# Altium schematic sheet Base_Module.SchDoc
size B; SheetNumber: 2; SheetTotal: 4
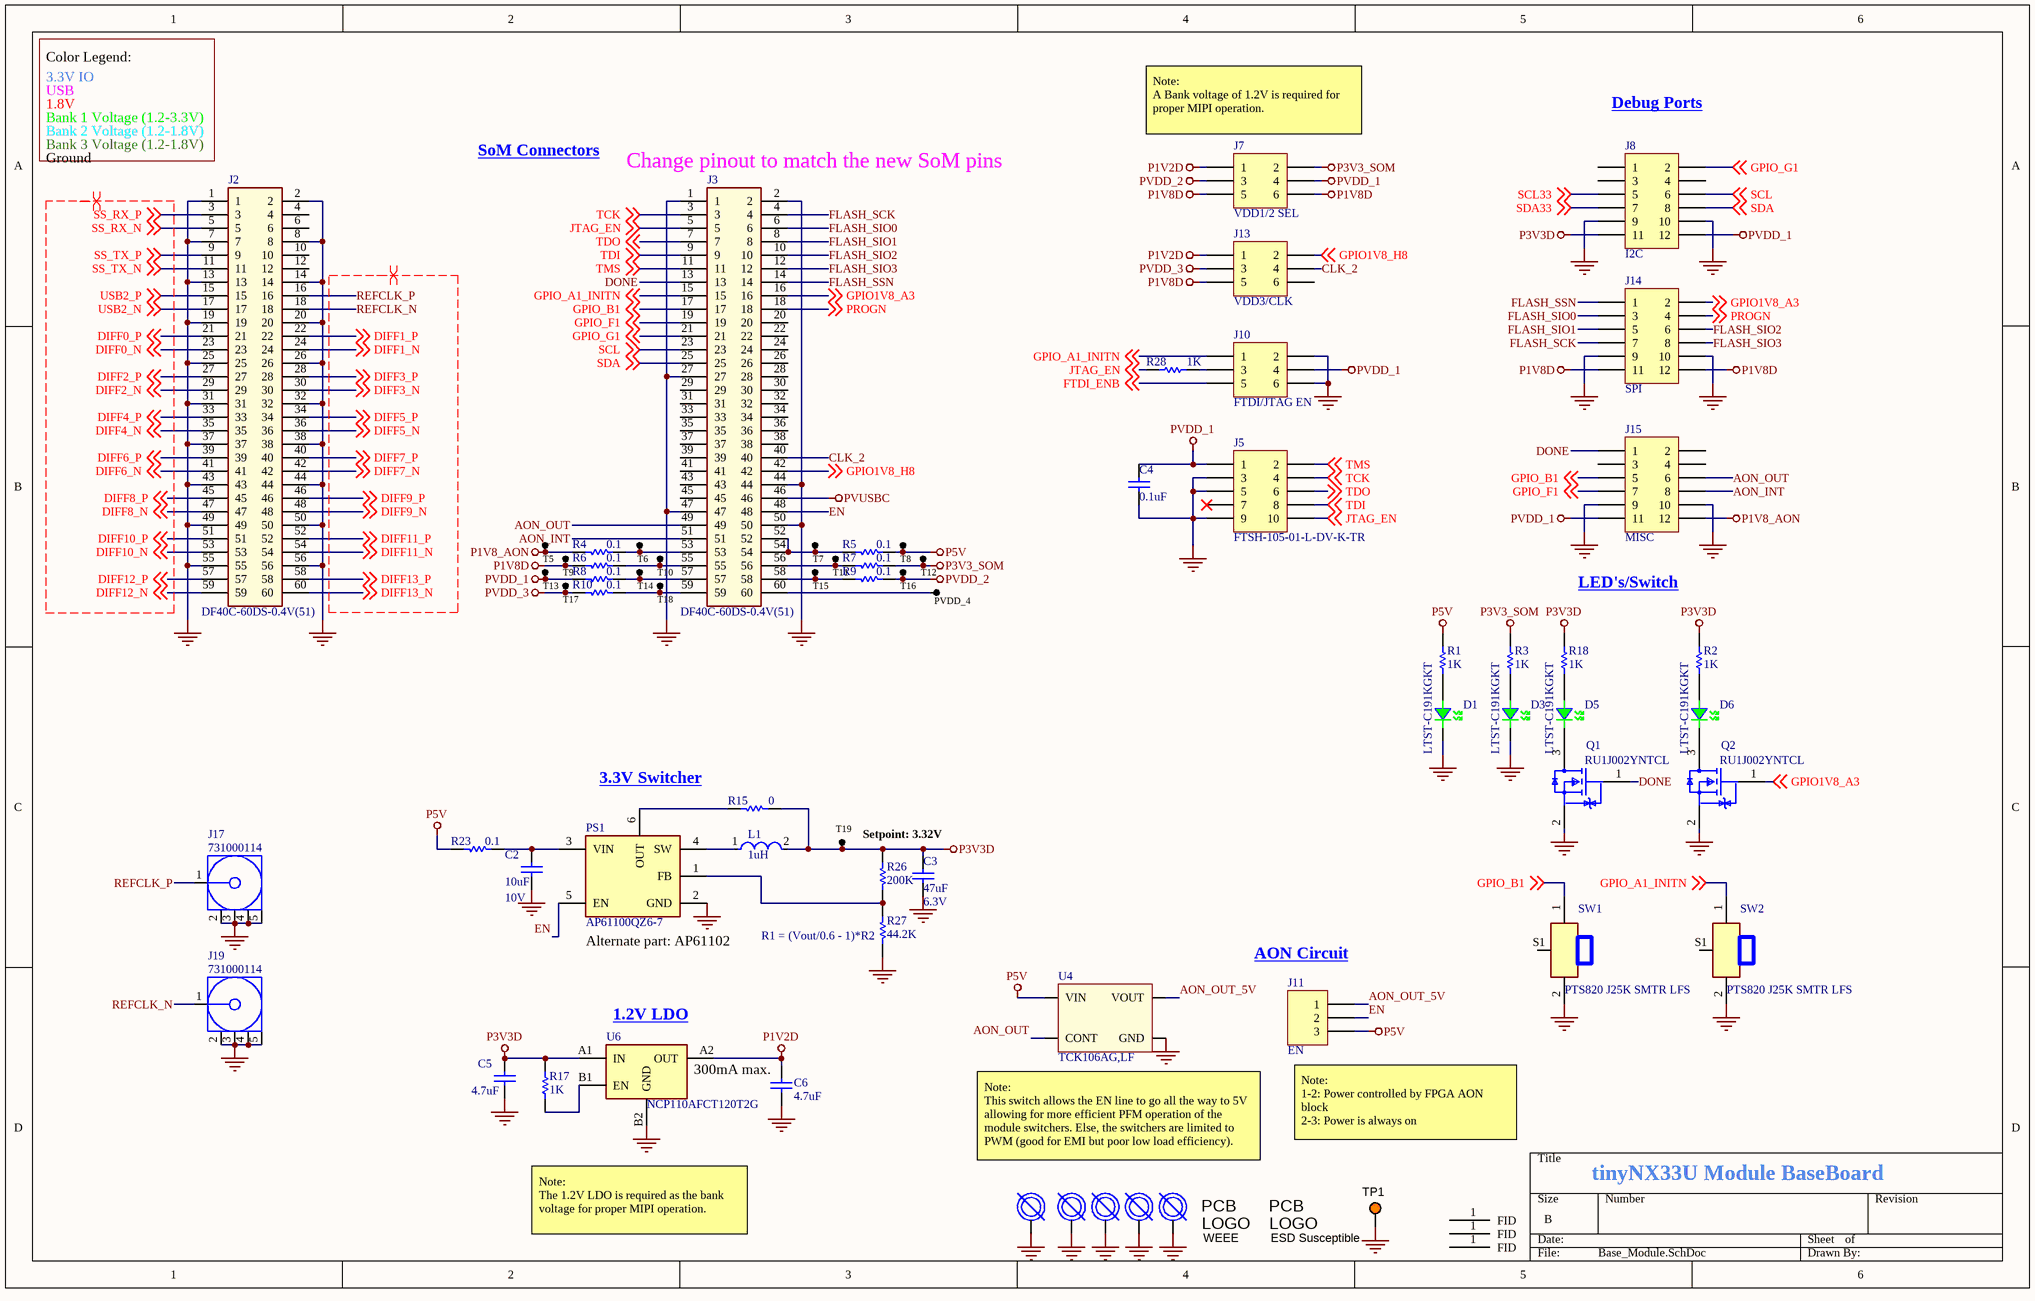
[diagram p0: Base_Module.SchDoc]

## Parts
BH1  STANDOFF M2.5  [MH_3MM]  (value not drawn)  (no BOM)
BH2  STANDOFF M2.5  [MH_3MM]  (value not drawn)  (no BOM)
BH3  STANDOFF M2.5  [MH_3MM]  (value not drawn)  (no BOM)
BH4  STANDOFF M2.5  [MH_3MM]  (value not drawn)  (no BOM)
BH5  STANDOFF M2.5  [MH_3MM]  (value not drawn)  (no BOM)
C2  10uF  Voltage: 10V  [CAP_0603]
C3  47uF  Voltage: 6.3V  [CAP_0603]
C4  0.1uF  [CAPC1005X55USR]
C5  4.7uF  [CAPC1005X55USR]
C6  4.7uF  [CAPC1005X55USR]
D1  LTST-C191KGKT  [LED_0603]
D3  LTST-C191KGKT  [LED_0603]
D5  LTST-C191KGKT  [LED_0603]
D6  LTST-C191KGKT  [LED_0603]
FID1  (no value)  [FID_040]  (no BOM)
FID2  (no value)  [FID_040]  (no BOM)
FID3  (no value)  [FID_040]  (no BOM)
J2  DF40C-60DS-0.4V(51)  [DF40C60DS04V51]
J3  DF40C-60DS-0.4V(51)  [DF40C60DS04V51]
J5  FTSH-105-01-L-DV-K-TR  [FTSH-105-01-XXX-DV-K]
J7  Content: VDD1/2 SEL  [HDR3X2_MALE_2.54MM_SAMTEC-A-TSM-103]  (hidden comment: Header 3X2_SMD)
J8  Content: I2C  [HDR6X2_MALE_2.54MM_SAMTEC-A-TSM-106]  (hidden comment: Header 6X2_SMD)
J10  Content: FTDI/JTAG EN  [HDR3X2_MALE_2.54MM_SAMTEC-A-TSM-103]  (hidden comment: Header 3X2_SMD)
J11  Content: EN  [HDR3X1_MALE_2.54MM]  (hidden comment: Header 3X1_2.54MM)
J13  Content: VDD3/CLK  [HDR3X2_MALE_2.54MM_SAMTEC-A-TSM-103]  (hidden comment: Header 3X2_SMD)
J14  Content: SPI  [HDR6X2_MALE_2.54MM_SAMTEC-A-TSM-106]  (hidden comment: Header 6X2_SMD)
J15  Content: MISC  [HDR6X2_MALE_2.54MM_SAMTEC-A-TSM-106]  (hidden comment: Header 6X2_SMD)
J17  731000114  [0731000114]
J19  731000114  [0731000114]
L1  1uH  [INDC2016X100N]
Logo1  WEEE  [WEEE_Minimum]  (no BOM)
Logo2  ESD Susceptible  [ESD_Overlay_Medium]  (no BOM)
PS1  AP61100QZ6-7  [SOTFL50P160X60-6N]
PVDD_4  TP_S  [TP_TH]  (value not drawn)  (no BOM)
Q1  RU1J002YNTCL  [SOT-323FL]
Q2  RU1J002YNTCL  [SOT-323FL]
R1  1K  [RESC1005X40USR]
R2  1K  [RESC1005X40USR]
R3  1K  [RESC1005X40USR]
R4  0.1  [RESC1005X40USR]
R5  0.1  [RESC1005X40USR]
R6  0.1  [RESC1005X40USR]
R7  0.1  [RESC1005X40USR]
R8  0.1  [RESC1005X40USR]
R9  0.1  [RESC1005X40USR]
R10  0.1  [RESC1005X40USR]
R15  0  [RESC1005X40USR]
R17  1K  [RESC1005X40USR]
R18  1K  [RESC1005X40USR]
R23  0.1  [RESC1005X40USR]
R26  200K  [RESC1005X40USR]
R27  44.2K  [RESC1005X40USR]
R28  1K  [RESC1005X40USR]
SW1  PTS820 J25K SMTR LFS  [PTS820J25MSMTRLFS]
SW2  PTS820 J25K SMTR LFS  [PTS820J25MSMTRLFS]
T5  TP_S  [TP_TH]  (value not drawn)  (no BOM)
T6  TP_S  [TP_TH]  (value not drawn)  (no BOM)
T7  TP_S  [TP_TH]  (value not drawn)  (no BOM)
T8  TP_S  [TP_TH]  (value not drawn)  (no BOM)
T9  TP_S  [TP_TH]  (value not drawn)  (no BOM)
T10  TP_S  [TP_TH]  (value not drawn)  (no BOM)
T11  TP_S  [TP_TH]  (value not drawn)  (no BOM)
T12  TP_S  [TP_TH]  (value not drawn)  (no BOM)
T13  TP_S  [TP_TH]  (value not drawn)  (no BOM)
T14  TP_S  [TP_TH]  (value not drawn)  (no BOM)
T15  TP_S  [TP_TH]  (value not drawn)  (no BOM)
T16  TP_S  [TP_TH]  (value not drawn)  (no BOM)
T17  TP_S  [TP_TH]  (value not drawn)  (no BOM)
T18  TP_S  [TP_TH]  (value not drawn)  (no BOM)
T19  3V3  [TP 1mm]  (value not drawn)  (no BOM)
TP1  5019  [TP380X203]  (value not drawn)
U4  TCK106AG,LF  [WCSP4D]
U6  NCP110AFCT120T2G  [WLCSP4_P6XP6_ONS]

## Nets
GND: BH1.1 BH2.1 BH3.1 BH4.1 BH5.1 C2.1 C3.1 C4.1 C5.1 C6.1 D1.2(K) D3.2(K) J2.1 J2.2 J2.7 J2.8 J2.13 J2.14 J2.19 J2.20 J2.25 J2.26 J2.31 J2.32 J2.37 J2.38 J2.43 J2.44 J2.49 J2.50 J2.55 J2.56 J3.1 J3.2 J3.27 J3.44 J3.47 J3.50 J5.3 J5.5 J5.9 J8.9 J8.10 J10.2 J10.6 J14.9 J14.10 J15.9 J15.10 J17.2 J17.3 J17.4 J17.5 J19.2 J19.3 J19.4 J19.5 PS1.2(GND) Q1.2(S) Q2.2(S) R27.1 SW1.2 SW2.2 TP1.1 U4.B1(GND) U6.B2(GND)
P1V2D: C6.2 J7.1 J13.1 U6.A2(OUT)
P1V8_AON: J15.12 R4.2 T5.1
P1V8D: J7.5 J7.6 J13.5 J14.11 J14.12 R6.2 T9.1
P3V3_SOM: J7.2 R3.1 R7.1 T12.1
P3V3D: C3.2 C5.2 J8.11 L1.2 R2.1 R15.1 R17.1 R18.1 R26.2 T19.1 U6.A1(IN)
P5V: J11.3 R1.1 R5.1 R23.2 T8.1 U4.A2(VIN)
PVDD_1: C4.2 J5.1 J7.4 J8.12 J10.4 J15.11 R8.2 T13.1
PVDD_2: J7.3 R9.1 T16.1
PVDD_3: J13.3 R10.2 T17.1
PVUSBC: J3.46
AON_INT: J3.51 J15.8
AON_OUT: J3.49 J15.6 U4.B2(CONT)
AON_OUT_5V: J11.1 U4.A1(VOUT)
CLK_2: J3.40 J13.4
DIFF0_N: J2.23 ; off-sheet DIFF0_N
DIFF0_P: J2.21 ; off-sheet DIFF0_P
DIFF1_N: J2.24 ; off-sheet DIFF1_N
DIFF1_P: J2.22 ; off-sheet DIFF1_P
DIFF2_N: J2.29 ; off-sheet DIFF2_N
DIFF2_P: J2.27 ; off-sheet DIFF2_P
DIFF3_N: J2.30 ; off-sheet DIFF3_N
DIFF3_P: J2.28 ; off-sheet DIFF3_P
DIFF4_N: J2.35 ; off-sheet DIFF4_N
DIFF4_P: J2.33 ; off-sheet DIFF4_P
DIFF5_N: J2.36 ; off-sheet DIFF5_N
DIFF5_P: J2.34 ; off-sheet DIFF5_P
DIFF6_N: J2.41 ; off-sheet DIFF6_N
DIFF6_P: J2.39 ; off-sheet DIFF6_P
DIFF7_N: J2.42 ; off-sheet DIFF7_N
DIFF7_P: J2.40 ; off-sheet DIFF7_P
DIFF8_N: J2.47 ; off-sheet DIFF8_N
DIFF8_P: J2.45 ; off-sheet DIFF8_P
DIFF9_N: J2.48 ; off-sheet DIFF9_N
DIFF9_P: J2.46 ; off-sheet DIFF9_P
DIFF10_N: J2.53 ; off-sheet DIFF10_N
DIFF10_P: J2.51 ; off-sheet DIFF10_P
DIFF11_N: J2.54 ; off-sheet DIFF11_N
DIFF11_P: J2.52 ; off-sheet DIFF11_P
DIFF12_N: J2.59 ; off-sheet DIFF12_N
DIFF12_P: J2.57 ; off-sheet DIFF12_P
DIFF13_N: J2.60 ; off-sheet DIFF13_N
DIFF13_P: J2.58 ; off-sheet DIFF13_P
DONE: J3.13 J15.1 Q1.1(G)
EN: J3.48 J11.2 PS1.5(EN)
FLASH_SCK: J3.4 J14.7
FLASH_SIO0: J3.6 J14.3
FLASH_SIO1: J3.8 J14.5
FLASH_SIO2: J3.10 J14.6
FLASH_SIO3: J3.12 J14.8
FLASH_SSN: J3.14 J14.1
FTDI_ENB: J10.5 ; off-sheet FTDI_ENB
GPIO1V8_A3: J3.16 J14.2 Q2.1(G) ; off-sheet GPIO1V8_A3
GPIO1V8_H8: J3.42 J13.2 ; off-sheet GPIO1V8_H8
GPIO_A1_INITN: J3.15 J10.1 SW2.1 ; off-sheet GPIO_A1_INITN
GPIO_B1: J3.17 J15.5 SW1.1 ; off-sheet GPIO_B1
GPIO_F1: J3.19 J15.7 ; off-sheet GPIO_F1
GPIO_G1: J3.21 J8.2 ; off-sheet GPIO_G1
JTAG_EN: J3.5 J5.10 R28.1 ; off-sheet JTAG_EN
PROGN: J3.18 J14.4 ; off-sheet PROGN
REFCLK_N: J2.18 J19.1
REFCLK_P: J2.16 J17.1
SCL: J3.23 J8.6 ; off-sheet SCL
SCL33: J8.5 ; off-sheet SCL33
SDA: J3.25 J8.8 ; off-sheet SDA
SDA33: J8.7 ; off-sheet SDA33
SS_RX_N: J2.5 ; off-sheet SS_RX_N
SS_RX_P: J2.3 ; off-sheet SS_RX_P
SS_TX_N: J2.11 ; off-sheet SS_TX_N
SS_TX_P: J2.9 ; off-sheet SS_TX_P
TCK: J3.3 J5.4 ; off-sheet TCK
TDI: J3.9 J5.8 ; off-sheet TDI
TDO: J3.7 J5.6 ; off-sheet TDO
TMS: J3.11 J5.2 ; off-sheet TMS
USB2_N: J2.17 ; off-sheet USB2_N
USB2_P: J2.15 ; off-sheet USB2_P
NetC2_2: C2.2 PS1.3(VIN) R23.1
NetD1_1: D1.1(A) R1.2
NetD3_1: D3.1(A) R3.2
NetD5_1: D5.1(A) R18.2
NetD5_2: D5.2(K) Q1.3(D)
NetD6_1: D6.1(A) R2.2
NetD6_2: D6.2(K) Q2.3(D)
NetJ3_52: J3.52 J3.54 R5.2 T7.1
NetJ3_53: J3.53 R4.1 T6.1
NetJ3_55: J3.55 R6.1 T10.1
NetJ3_56: J3.56 R7.2 T11.1
NetJ3_57: J3.57 R8.1 T14.1
NetJ3_58: J3.58 R9.2 T15.1
NetJ3_59: J3.59 R10.1 T18.1
NetJ3_60: J3.60 PVDD_4.1
NetJ10_3: J10.3 R28.2
NetL1_1: L1.1 PS1.4(SW)
NetPS1_1: PS1.1(FB) R26.1 R27.2
NetPS1_6: PS1.6(OUT) R15.2
NetR17_2: R17.2 U6.B1(EN)

Not connected (* = marked no-connect by the designer): FID1 1(FID); FID2 1(FID); FID3 1(FID); J2 4 6 10 12; J3 20 22 24 26 28 29 30 31 32 33 34 35 36 37 38 39 41 43 45; J5 7*; J8 1 3 4; J13 6; J15 2 3 4; SW1 S1(GND); SW2 S1(GND)

## Layout directives
differential pair: DIFF0_N, DIFF0_P, DIFF1_N, DIFF1_P, DIFF2_N, DIFF2_P, DIFF3_N, DIFF3_P, DIFF4_N, DIFF4_P, DIFF5_N, DIFF5_P, DIFF6_N, DIFF6_P, DIFF7_N, DIFF7_P, DIFF8_N, DIFF8_P, DIFF9_N, DIFF9_P, DIFF10_N, DIFF10_P, DIFF11_N, DIFF11_P, DIFF12_N, DIFF12_P, DIFF13_N, DIFF13_P, REFCLK_N, REFCLK_P, SS_RX_N, SS_RX_P, SS_TX_N, SS_TX_P, USB2_N, USB2_P

## Notes on the sheet
- 3.3V IO
- USB
- Color Legend:
- 1.8V
- Bank 2 Voltage (1.2-1.8V)
- Bank 1 Voltage (1.2-3.3V)
- Ground
- (near J2) Bank 3 Voltage (1.2-1.8V)
- SoM Connectors
- (near J7) Note:
  A Bank voltage of 1.2V is required for proper MIPI operation.
- Debug Ports
- (near J3) Change pinout to match the new SoM pins
- LED's/Switch
- 3.3V Switcher
- Setpoint: 3.32V
- (near PS1) Alternate part: AP61102
- (near R27) R1 = (Vout/0.6 - 1)*R2
- (near J11) AON Circuit
- (near U6) 1.2V LDO
- (near U6) 300mA max.
- Note:
  This switch allows the EN line to go all the way to 5V allowing for more efficient PFM operation of the module switchers. Else, the switchers are limited to PWM (good for EMI but poor low load efficiency).
- (near J11) Note:
  1-2: Power controlled by FPGA AON block
  2-3: Power is always on
- tinyNX33U Module BaseBoard
- Note:
  The 1.2V LDO is required as the bank voltage for proper MIPI operation.
- (in symbol Logo ESD) PCB; LOGO
- (in symbol Logo WEEE) PCB; LOGO

## Library data of the parts
BH1-BH5 = MOUNT_HOLE: ROUND STANDOFF M2X0.4 STEEL 1MM
C2 = Cap_1uF_X5R_10%_6V3_0402: CAP CER 10uF 10V X5R 0603; Manufacturer Part Number: GRM188R61A106ME69D; Manufacturer: Murata Electronics; Supplier Part Number 1: 490-10475-1-ND; Package: 0603; value: 10uF; Supplier 1: Digi-Key; Height: 0.95mm; ComponentLink1Description: New link; ComponentLink1URL: *
C3 = Cap_1uF_X5R_10%_6V3_0402: CAP CER 47UF 6.3V X5R 0603; Manufacturer Part Number: GRM188R60J476ME15D; Manufacturer: Murata Electronics; Supplier Part Number 1: 490-13247-1-ND; Package: 0603; value: 47uF; Supplier 1: Digi-Key; Height: 1.0mm; ComponentLink1Description: New link; ComponentLink1URL: *
C4 = CAP CER 0.1UF 16V X7R 0402: Manufacturer Part Number: CGA2B1X7R1C104K050BC; Manufacturer: TDK Corporation; Supplier Part Number 1: 445-5613-2-ND; Package: 0402; Height: 0.55mm; Supplier 1: Digi-Key; value: 0.1uF
C5 C6 = CAP CER 4.7UF 10V X5R 0402: Manufacturer Part Number: C1005X5R1A475M050BC; Manufacturer: TDK Corporation; Supplier Part Number 1: 445-8023-1-ND; Package: 0402; value: 4.7uF; Supplier 1: Digi-Key; Height: 0.55mm; ComponentLink1Description: New link; ComponentLink1URL: *
D1 D3 D5 D6 = 0603LED_GRN: LED GREEN CLEAR CHIP 0603 SMD; Manufacturer: Lite-On Inc.; Manufacturer Part Number: LTST-C191GKT; Unit Cost, Qty 1: $0.68; Unit Cost, Qty 500: $0.293; Supplier Part Number 1: 160-1443-1-ND; Value: LTST-C191KGKT; Supplier 1: Digi-Key
FID1-FID3 = FID: Notes: DNP
J2 J3 = DF40C-60DS-0.4V(51): CONN RCPT 60POS SMD GOLD; Manufacturer: Hirose; Connector Type: Receptacle; Number of Positions: 60; Current Rating: 300mA; Voltage Rating: 30V; Pitch: 0.4mm; Mated Stacking Heights: 1.5mm; Manufacturer Part Number: DF40C-60DS-0.4V(51); RoHS: Yes; Category: Headers and Wire Housings; Stock: 11621; Pricing: 1=1.29000, 10=1.08900, 25=1.04440, 50=1.02220, 100=0.97770, 250=0.88880, 500=0.79992, 1000=0.71104, 2500=0.64438 (USD); Mounting Technology: Surface Mount; Contact Plating: Gold; Contact Material: Bronze; Housing Material: Polymer; Package Quantity: 5000; Number of Rows: 2; Packaging: Tape and Reel; Series: DF40; Termination: SMD/SMT; Number of Contacts: 60; Gender: Receptacle; RoHS Compliant: Yes; Lead Free: Lead Free; Reach SVHC Compliant: No; ComponentLink1URL: https://datasheet.ciiva.com/46408/1824826-46408909.pdf?src-supplier=Element14; ComponentLink1Description: https://datasheet.ciiva.com/46408/1824826-46408909.pdf?src-supplier=Element14; Supplier 1: Digi-Key; Supplier Part Number 1: 26-DF40C-60DS-0.4V(51)CT-ND
J5 = HDR2X5_1.27mm: CONN HEADER SMD 10POS 1.27MM; Manufacturer: Samtec Inc.; Max Current Rating: 1.75A; Number of Contacts: 10; Gender: Male; Connector Type: Male Pin; Row Spacing: 0.05inch; Supplier 1: Digi-Key; Supplier Part Number 1: SAM13165CT-ND; Manufacturer Part Number: FTSH-105-01-L-DV-K-TR; RoHS: Yes; Category: Headers and Wire Housings; Stock 1: 18878; Pricing 1: 1=4.28000, 10=3.88500, 100=3.42300 (USD); Mount: Surface Mount; Contact Plating: Gold; Contact Material: Bronze; Housing Color: Black; Housing Material: Polymer; Color: Black; Min Operating Temperature: -55°C; Max Operating Temperature: 125°C; Number of Rows: 2; Packaging: Tape and Reel; Termination: Solder; Orientation: Straight; Package Quantity: 550; Number of Positions: 10; Current Rating: 1.75A; Series: FTSH; Contact Type: Male Pin; Length: 6.35mm; Pitch: 1.27mm; Depth: 3.43mm; Contact Mating Length: 0.12inch; Radiation Hardening: No; Lead Free: Lead Free; RoHS Compliant: Yes; REACH SVHC: No SVHC; ComponentLink1URL: https://datasheet.ciiva.com/10245/ftsh-mt-10245289.pdf?src-supplier=Avnet; ComponentLink1Description: https://datasheet.ciiva.com/10245/ftsh-mt-10245289.pdf?src-supplier=Avnet; ComponentLink2URL: https://datasheet.ciiva.com/739/ftsh-1xx-xx-xxx-dv-xxx-mkt-739005.pdf?src-supplier=Digi-Key; ComponentLink2Description: https://datasheet.ciiva.com/739/ftsh-1xx-xx-xxx-dv-xxx-mkt-739005.pdf?src-supplier=Digi-Key; ComponentLink3URL: https://datasheet.ciiva.com/23735/81359-23735917.pdf?src-supplier=Newark; ComponentLink3Description: https://datasheet.ciiva.com/23735/81359-23735917.pdf?src-supplier=Newark
J7 J10 J13 = Header 3X2_SMD: Conn Unshrouded Header HDR 6 POS 2.54mm Solder ST Top Entry SMD Tube; Manufacturer: Samtec; Manufacturer Part Number: TSM-103-01-L-DV; Number of Positions: 6; Gender: Male; Max Current Rating: 7A; Max Voltage Rating (AC): 475V; Row Spacing: 0.1inch; Supplier 1: Digi-Key; Supplier Part Number 1: SAM10786-ND; RoHS: Yes; Category: Headers and Wire Housings; Stock: 12257; Pricing: 1=1.17000, 10=0.99000, 100=0.88880, 500=0.72720, 1000=0.64640, 5000=0.56560, 10000=0.53732 (USD); ComponentLink1URL: https://datasheet.ciiva.com/25616/0900766b81157e6c-25616863.pdf?src-supplier=Rs; ComponentLink1Description: https://datasheet.ciiva.com/25616/0900766b81157e6c-25616863.pdf?src-supplier=Rs; ComponentLink2URL: https://datasheet.ciiva.com/739/tsm-1xx-xx-xxx-xx-x-xxx-x-mkt-739577.pdf?src-supplier=Digi-Key; ComponentLink2Description: https://datasheet.ciiva.com/739/tsm-1xx-xx-xxx-xx-x-xxx-x-mkt-739577.pdf?src-supplier=Digi-Key; Mounting Technology: Surface Mount; Contact Plating: Gold; Contact Material: Bronze; Color: Black; Housing Color: Black; Housing Material: Polymer; Min Operating Temperature: -55°C; Max Operating Temperature: 125°C; Packaging: Rail/Tube; Number of Rows: 2; Termination: Solder; Number of Contacts: 6; Orientation: Straight; Series: TSM; Contact Type: Male Pin; Package Quantity: 1; Current Rating: 7A; Voltage Rating: 475V; Length: 7.62mm; Pitch: 2.54mm; Depth: 7.36mm; Contact Mating Length: 0.23inch; Radiation Hardening: No; Lead Free: Lead Free; RoHS Compliant: Yes; Reach SVHC Compliant: No
J8 J14 J15 = Header 6X2_SMD: Conn Unshrouded Header HDR 12 POS 2.54mm Solder ST Top Entry SMD Tube; Manufacturer: Samtec; Manufacturer Part Number: TSM-106-01-L-DV; Number of Contacts: 12; Gender: Male; Pitch: 0.1inch; Supplier 1: Digi-Key; Supplier Part Number 1: SAM10803-ND; RoHS: Yes; Category: Headers and Wire Housings; Stock: 6386; Pricing: 1=2.21000, 10=1.92300, 100=1.71800, 500=1.43168, 1000=1.22715, 5000=1.08807 (USD); ComponentLink1URL: https://datasheet.ciiva.com/739/tsm-1xx-xx-xxx-xx-x-xxx-x-mkt-739673.pdf?src-supplier=Digi-Key; ComponentLink1Description: https://datasheet.ciiva.com/739/tsm-1xx-xx-xxx-xx-x-xxx-x-mkt-739673.pdf?src-supplier=Digi-Key; Mounting Technology: Surface Mount; Contact Plating: Gold; Contact Material: Bronze; Contact Shape: Square; Contact Finish - Mating: GOLD; Insulation Material: Polymer; Insulation Color: Black; Color: Black; Min Operating Temperature: -55°C; Max Operating Temperature: 125°C; Number of Rows: 2; Packaging: Rail/Tube; Termination: Solder; Number of Positions: 12; Connector Type: Header; Series: TSM; Contact Type: Male Pin; Fastening Type: Pull; Package Quantity: 1; Row Spacing: 0.1inch; Contact Mating Length: 0.23inch; Radiation Hardening: No; Lead Free: Lead Free; RoHS Compliant: Yes; Flammability Rating: UL94 V-0; Reach SVHC Compliant: No
J11 = Header 3X1_2.54MM: CONN HEADER .100 SNGL STR 3POS; Manufacturer: Sullins; Manufacturer Part Number: PRPC003SAAN-RC; Number of Positions: 3; Pitch: 0.1inch; Supplier 1: Digi-Key; Supplier Part Number 1: S1011EC-03-ND; RoHS: Yes; Category: Connectors; Stock: 16156; Pricing: 1=0.12000, 10=0.10900, 25=0.08120, 50=0.06960, 100=0.06730, 250=0.05804, 500=0.05572 (USD); Mounting Technology: Through Hole; Color: Black; Contact Plating: Gold; Package Quantity: 1; Number of Rows: 1; Packaging: Bulk; Termination: Solder; Series: -; Contact Type: Male Pin; Contact Mating Length: 0.23inch; RoHS Compliant: Yes; ComponentLink1URL: https://datasheet.ciiva.com/741/xrxczzzsxxn-rc-st-11635-b-741242.pdf?src-supplier=Digi-Key; ComponentLink1Description: https://datasheet.ciiva.com/741/xrxczzzsxxn-rc-st-11635-b-741242.pdf?src-supplier=Digi-Key
J17 J19 = CN-S-4F-RF5: SMA Right-Angle PCB Jack Receptacle, Brass Body, Gold Plated, 50 Ohm, 5-Pin THD, RoHS, Tray; Manufacturer: Molex; Manufacturer Part Number: 73100-0114; Dielectric Material: PTFE; Impedance: 50R; Connector Type: PCB,SMA,Coaxial; Clock Frequency: 18GHz; Voltage Rating: 500V; Polarity: Normal; Operating Frequency: 0 to 12Hz; Gender: Female; Number of Contacts: 1NUMBER; Supplier 1: Digi-Key; Supplier Part Number 1: WM5525-ND; RoHS: Yes; Category: RF / Coaxial Connectors; Stock: 19371; Pricing: 1=8.01000, 10=7.00800, 80=5.67300, 1760=4.57174 (USD); Mounting Technology: Through Hole; Case/Package: SMA; Contact Material: Copper; Contact Plating: Gold; Body Material: Brass; Body Plating: Gold; Housing Color: Gold; Center Contact Plating: Gold; Insulation Material: Teflon; Plating: Gold; Min Operating Temperature: -65°C; Max Operating Temperature: 165°C; Termination: Solder; Package Quantity: 1760; Packaging: Tray; Series: 73100; Fastening Type: Threaded; Orientation: Right Angle; Length: 14.8mm; Radiation Hardening: No; RoHS Compliant: Yes; Reach SVHC Compliant: Unknown; Halogen Free: 5696HalogenFree; Lead Free: 5697LeadFree
L1 = 725321dda6339637d4d059423bc1c3c: FIXED IND 1UH 2.7A 57 MOHM SMD; Manufacturer: Murata Electronics; Manufacturer Part Number: DFE201610E-1R0M=P2; Supplier Part Number 1: 490-18106-1-ND; value: 1uH
Logo1 = Logo WEEE: WEEE logo; Library Reference: WEEE logo; Lib Reference: WEEE logo; PartNumber: WEEE logo
Logo2 = Logo ESD: ESD Susceptible Symbol; Library Reference: Logo; SymbolCreator: a0412235; Lib Reference: ESD_Susceptible; Publisher: Texas Instruments; SymbolVersion: 2011-08-22; Published: 2009-03-03; LatestRevisionDate: 2017-07-06; PartNumber: ESD Susceptible
PS1 = AP61102Z6-7: DC-DC CONV LV BUCK SOT563; Manufacturer: Diodes Incorporated; Height: 0.6mm; Manufacturer Part Number: AP61100QZ6-7; Supplier 1: Digi-Key; Supplier Part Number 1: 31-AP61100QZ6-7TR-ND
PVDD_4 T5-T19 = TP_S: test point
Q1 Q2 = 1926738d861a973c8d722c53ec8fd09: MOSFET N-CH 50V 0.2A UMT3F; Manufacturer: Rohm; Drain To Source Resistance: 1.6Ω; Depletion Mode: False; Continuous Drain Current: 200mA; Pulse Drain Current: 800mA; Turn On Delay Time: 5ns; Threshold Vgs Max: 0.8V; Rthja Max: 833°C/W; Max Forward Diode Voltage: 1.2V; Max Junction Temp: +150°C; Standoff Height: 0mm; Input Capacitace At Vds: 26pF @ 10V; Number Of Channels: 1; Power Dissipation: 150mW; Gate To Source Voltage: 8V; Turn Off Delay Time: 17ns; Threshold Vgs Min: 0.3V; Lead Free: Yes; Device Class L3: MOSFETs; Drain To Source Voltage: 50V; ComponentLink2URL: https://d1d2qsbl8m0m72.cloudfront.net/en/products/databook/datasheet/discrete/transistor/mosfet/ru1j002yn-e.pdf; RoHS: TRUE; Device Class L2: Transistors; Mouser Description: MOSFET 0.9V Drive Nch MOSFET; Category: Trans; Octopart: https://octopart.com/ru1j002yntcl-rohm-47197697; Temperature: to +150°C; Height: 1.05mm; Number Of N Channels: 1; Package: UMT3F; ComponentLink2Description: Datasheet; Automotive: No; Drain To Source Breakdown Voltage: 50V; Device Class L1: Discrete Semiconductors; Supplier Part Number 1: 755-RU1J002YNTCL; Manufacturer Part Number: RU1J002YNTCL; Supplier 1: Mouser
R1-R3 R17 R18 R28 = RES 1K OHM 1% 1/16W 0402: RES SMD 1K OHM 1% 1/16W 0402; Manufacturer: YAGEO; Manufacturer Part Number: RC0402FR-071KL; Supplier Part Number 1: 311-1.00KLRCT-ND; Package: 0402; Height: 0.4mm; Supplier 1: Digi-Key; value: 1K
R4-R10 R23 = RES 0.5 OHM 1% 1/8W 0402: RES 0.1 OHM 1% 1/8W 0402; Manufacturer Part Number: CSR0402FKR100; Manufacturer: Stackpole Electronics Inc; Package: 0402; Supplier Part Number 1: CSR0402FKR100CT-ND; value: 0.1; Height: 0.43mm; Supplier 1: Digi-Key
R15 = RES 0 OHM JUMPER 1/20W 0201: RES 0 OHM JUMPER 1/16W 0402; Manufacturer: Yageo; Manufacturer Part Number: RC0402JR-070RL; Supplier Part Number 1: 311-0.0JRCT-ND; Package: 0402; Height: 0.4mm; Supplier 1: Digi-Key; value: 0
R26 = Res_10K_1%_0402: RES SMD 200K OHM 1% 1/16W 0402; Manufacturer: Stackpole Electronics Inc; Manufacturer Part Number: RMCF0402FT200K; Supplier Part Number 1: RMCF0402FT200KTR-ND; Package: 0402; Height: 0.4mm; Supplier 1: Digi-Key; value: 200K
R27 = Res_10K_1%_0402: RES SMD 44.2K OHM 1% 1/16W 0402; Manufacturer: Yageo; Manufacturer Part Number: RC0402FR-0744K2L; Supplier Part Number 1: YAG3163TR-ND; Package: 0402; Height: 0.4mm; Supplier 1: Digi-Key; value: 44.2K
SW1 SW2 = SPST_NO: SWITCH TACTILE SPST-NO 0.05A 12V; Manufacturer: C&K; Supplier Part Number 1: CKN10897CT-ND; Supplier 1: Digi-Key; Manufacturer Part Number: PTS820 J25K SMTR LFS
TP1 = 5019: PC TEST POINT MINIATURE; Manufacturer: Keystone Electronics; Supplier Part Number 1: 36-5019CT-ND; Manufacturer Part Number: 5019; ComponentLink2URL: http://keyelco.com/userAssets/file/M65p56.pdf; Supplier 1: Digi-Key; ComponentLink1Description: Manufacturer URL; ComponentLink1URL: http://www.keyelco.com/; ComponentLink2Description: Datasheet
U4 = TCK106AG: IC PWR SWITCH P-CHAN 1:1 4WCSPD; Vendor: Toshiba; Built_By: EMA_UL_Team; Number_devices_in_Package: 1; 1pc cost: $0.47; 100pc cost: $0.2349; Manufacturer Part Number: TCK106AG,LF; Copyright: Copyright (C) 2018 Accelerated Designs. All rights reserved; RefDes: RefDes; Type: DEV; Source_Package: TCK106AG; Supplier 1: Digi-Key; Manufacturer: Toshiba; Height: 0.55mm; Supplier Part Number 1: TCK106AGLFCT-ND
U6 = NCP110AFCT120T2G: LDO Regulator, 200 mA, Low Vin, Ultra-High PSRR 1.2V, Active Discharge; Manufacturer: ON Semiconductor; Supplier 1: Digi-Key; Manufacturer Part Number: NCP110AFCT120T2G; RoHS: Yes; Category: Voltage Regulators - Linear; Stock 1: 4650; Pricing 1: 1=0.41000, 10=0.33100, 25=0.30280, 100=0.22520, 250=0.20412, 500=0.16892, 1000=0.12669, 2500=0.11613 (USD); RoHS Compliant: Yes; Supplier Part Number 1: 488-NCP110AFCT120T2GCT-ND